# EasyEDA schematic RobotiCrawler.json
TITLE: Sheet_1; REV: 1.0; Date: 2019-01-26; Sheet: 1/1; Drawn By: ahmetakifkaya11; Company: Your Company
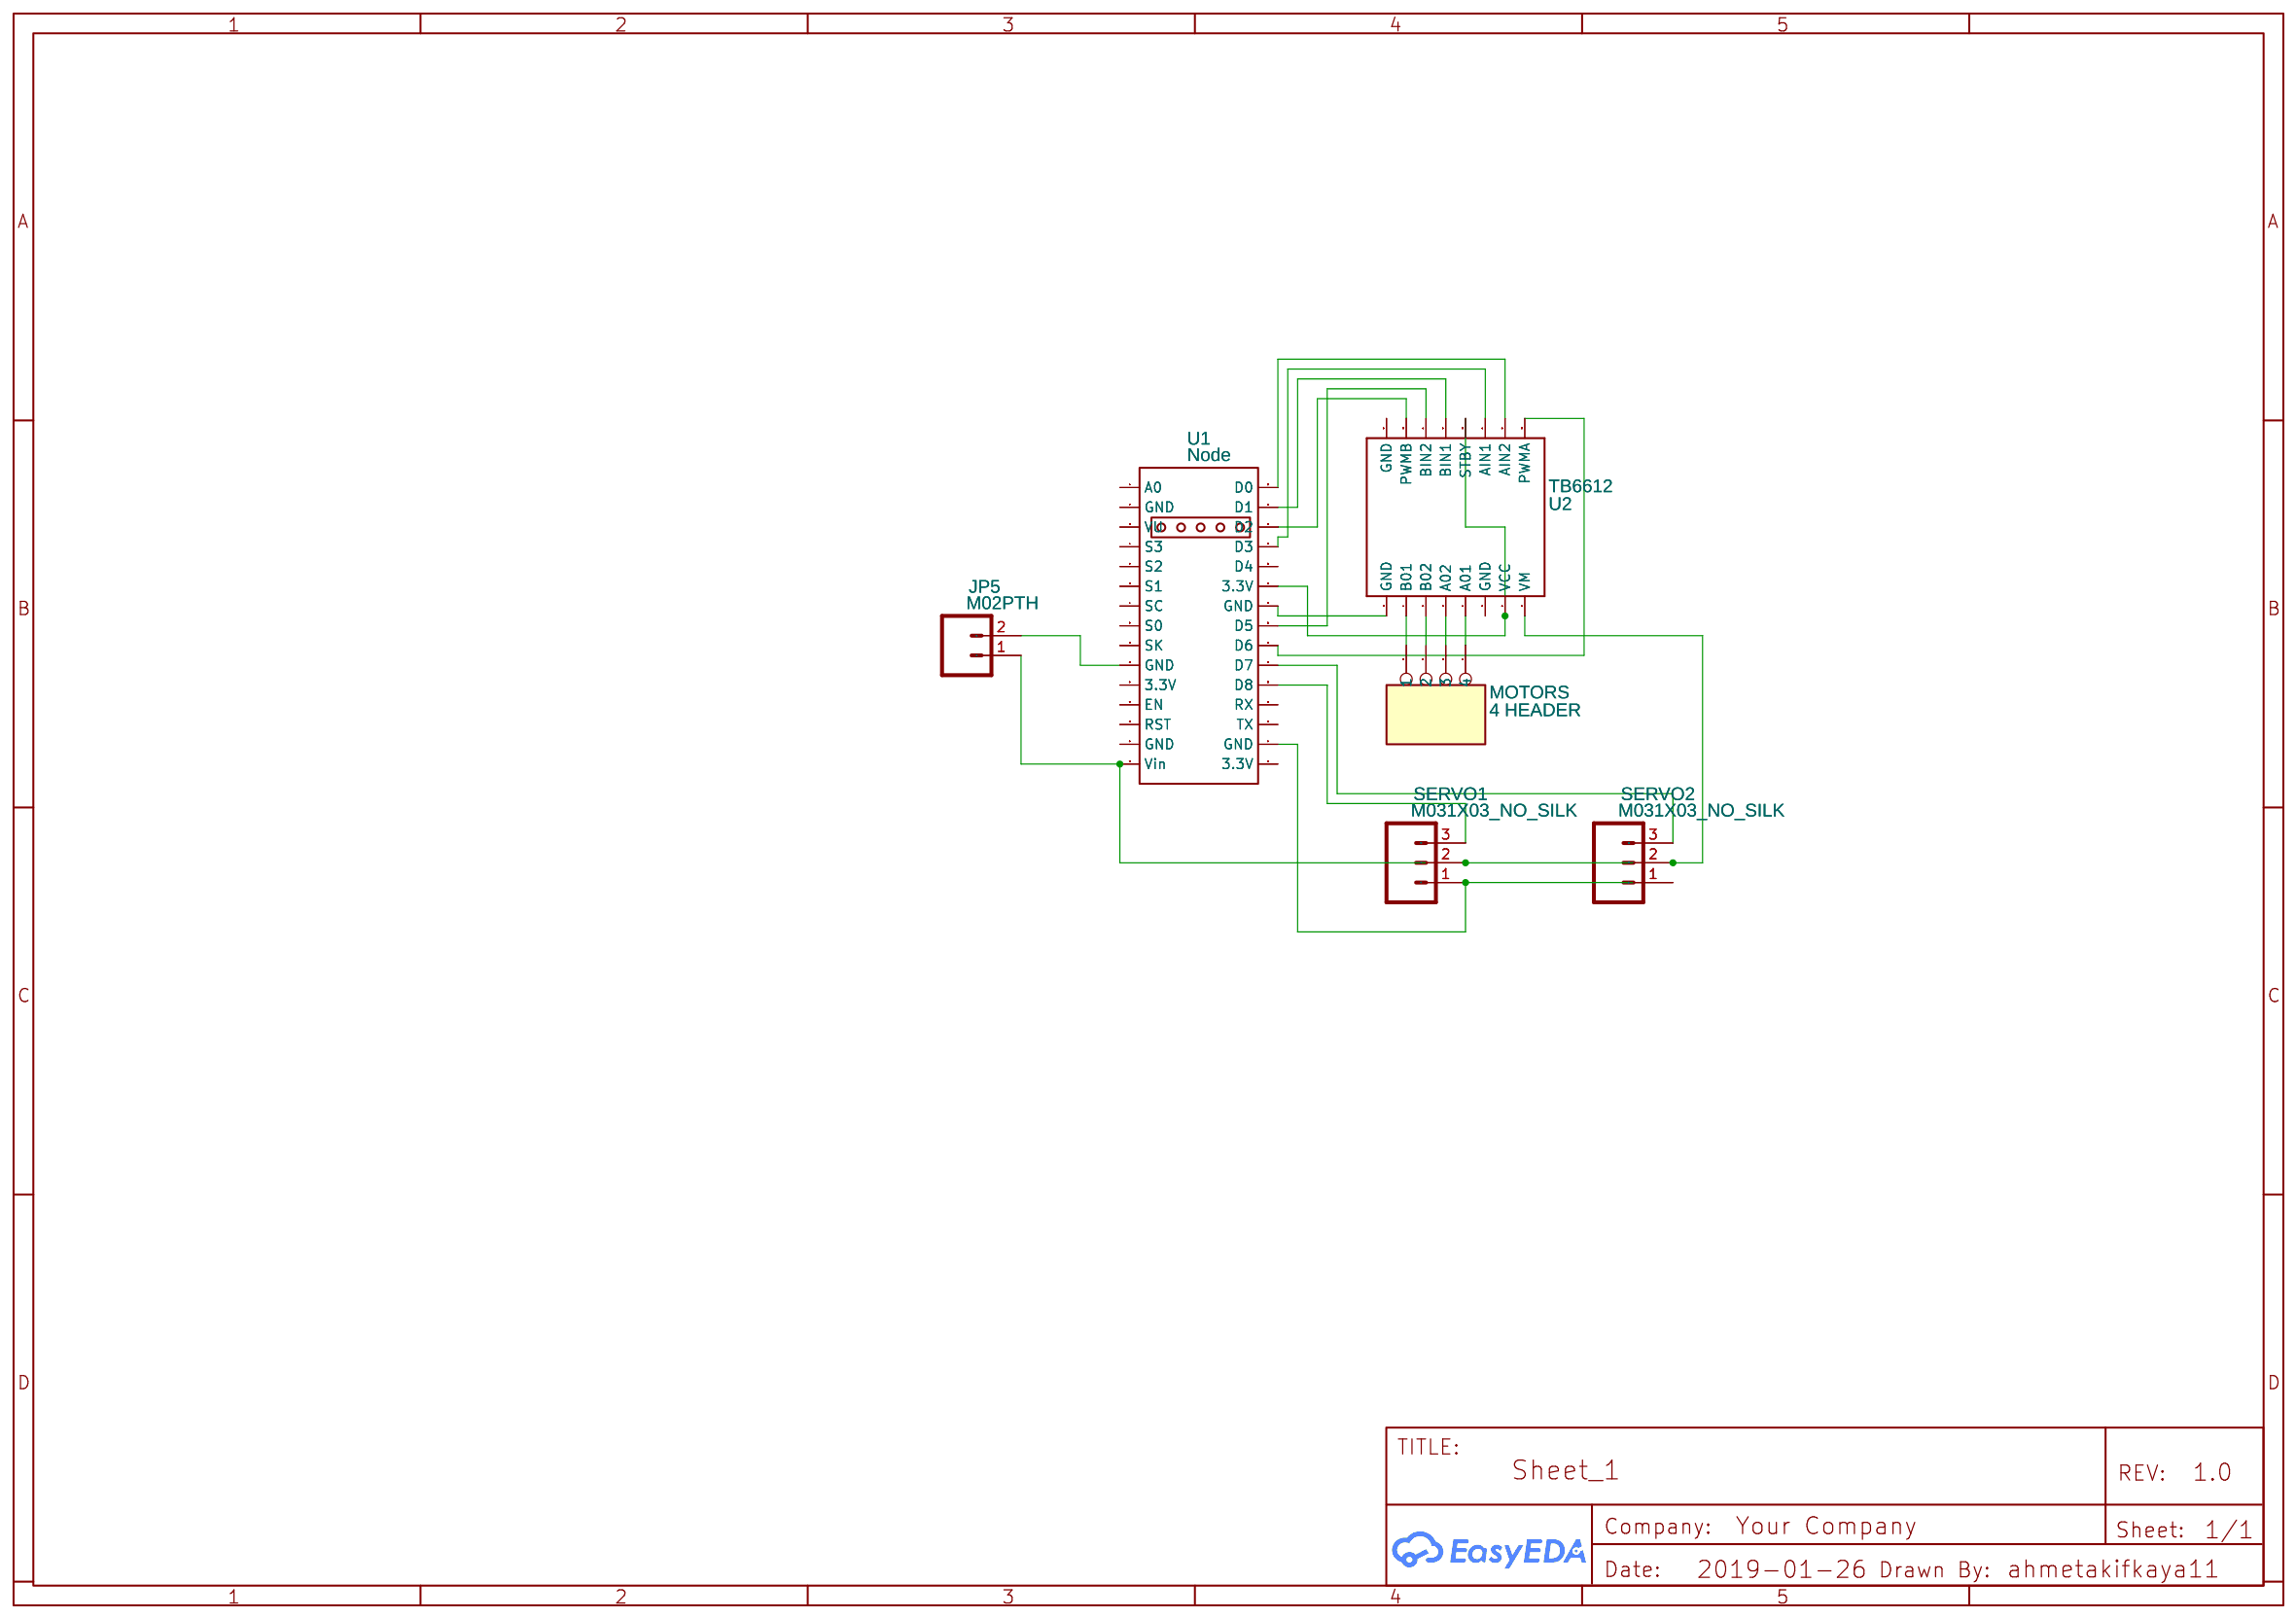
[diagram p0: schematic sheet]

## Parts
JP5  M02PTH  [1X02]
MOTORS  4 HEADER  [HEADER4]
SERVO1  M031X03_NO_SILK  [1X03_NO_SILK]
SERVO2  M031X03_NO_SILK  [1X03_NO_SILK]
U1  Node  [NODEMCU V3 LOLIN]
U2  TB6612  [DUAL TB6612FNG]

## Library data of the parts
JP5 = -: Header 2; Manufacturer Part: ?
MOTORS = -: 4 Pin Header; Manufacturer Part: ?
SERVO1 SERVO2 = -: Header 3; Contributor: SparkFun; Manufacturer Part: ?
U1 = -: Manufacturer Part: NodeMcu V3 LoLin; Contributor: nitink
U2 = -: TB6612 The TB6612FNG motor driver can control up to two DC motors at a constant current of 1.2A (3.2A peak).; Supplier: SparkFun; Manufacturer Part: ?

## Nets
Net-(JP5-1): JP5.1 SERVO1.2 SERVO2.2 U1.15(Vin) U2.1(VM)
Net-(JP5-2): JP5.2 U1.10(GND)
Net-(MOTORS-1): MOTORS.1 U2.7(B01)
Net-(MOTORS-2): MOTORS.2 U2.6(B02)
Net-(MOTORS-3): MOTORS.3 U2.5(A02)
Net-(MOTORS-4): MOTORS.4 U2.4(A01)
Net-(SERVO1-1): SERVO1.1 SERVO2.1 U1.17(GND)
Net-(SERVO1-3): SERVO1.3 U1.20(D8)
Net-(SERVO2-3): SERVO2.3 U1.21(D7)
Net-(U1-22): U1.22(D6) U2.16(PWMA)
Net-(U1-23): U1.23(D5) U2.11(BIN2)
Net-(U1-24): U1.24(GND) U2.8(GND)
Net-(U1-25): U1.25(3.3V) U2.2(VCC) U2.13(STBY)
Net-(U1-27): U1.27(D3) U2.14(AIN1)
Net-(U1-28): U1.28(D2) U2.10(PWMB)
Net-(U1-29): U1.29(D1) U2.12(BIN1)
Net-(U1-30): U1.30(D0) U2.15(AIN2)

Not connected (* = marked no-connect by the designer): U1 1(A0) 2(GND) 3(VU) 4(S3) 5(S2) 6(S1) 7(SC) 8(S0) 9(SK) 11(3.3V) 12(EN) 13(RST) 14(GND) 16(3.3V) 18(TX) 19(RX) 26(D4); U2 3(GND) 9(GND)
